# EAGLE design Simple_Boost_JST_to_1V8 (EAGLE 7.2.0)
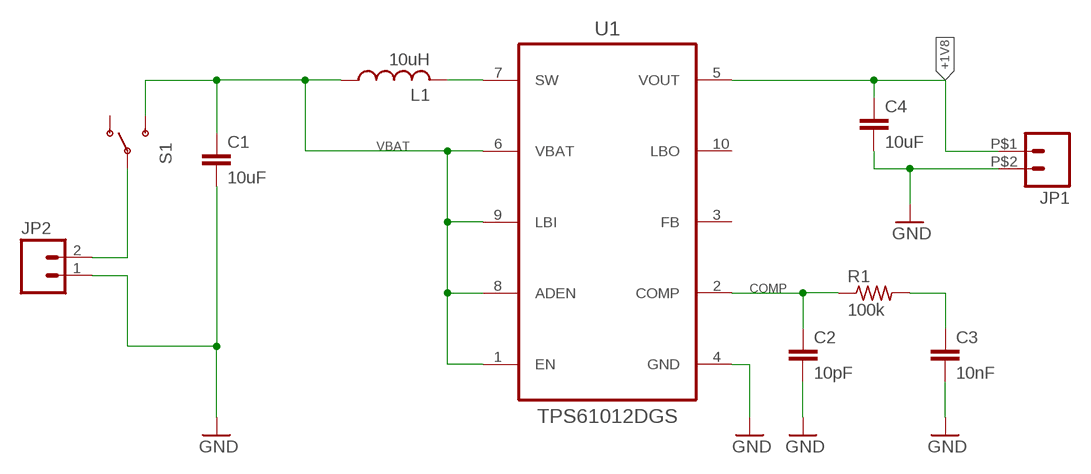
[diagram p0: schematic, sheet 1]

## Parts
C1  10uF  C-EUC1812  [C1812]
C2  10pF  C-EUC0805  [C0805]
C3  10nF  C-EUC0805  [C0805]
C4  10uF  C-EUC1812  [C1812]
JP1  M02TE-282834-2  [1X02_282834-2]
JP2  M02JST-PTH-2  [JST-2-PTH]
L1  10uH  SUMIDA_POWER_INDUCTOR6  [CDRH6D38]
R1  100k  R-US_R0805  [R0805]
S1  SWITCH-SPDTPTH  [SWITCH-SPDT]
U1  TPS61012DGS  [SOP50P490X110-10N]

## Nets
+1V8: C4.1 JP1.P$1 U1.5(VOUT)
COMP: C2.1 R1.1 U1.2(COMP)
GND: C1.2 C2.2 C3.2 C4.2 JP1.P$2 JP2.1 U1.4(GND)
N$1: C3.1 R1.2
N$2: JP2.2 S1.2(P)
SW: L1.P$2 U1.7(SW)
VBAT: C1.1 L1.P$1 S1.3(S) U1.1(EN) U1.6(VBAT) U1.8(ADEN) U1.9(LBI)
Unconnected: S1.1(O) U1.3(FB) U1.10(LBO)

## Library data of the parts
C1-C4 = rcl:C-EU: CAPACITOR, European symbol
JP1 = DensityAltitude:M02: Standard 2-pin 0.1" header. Use with - straight break away headers ( PRT-00116) - right angle break away headers (PRT-00553) - swiss pins (PRT-00743) - machine pins (PRT-00117) - female headers (PRT-00115) Molex polarized connector foot print use with: PRT-08233 with associated crimp pins and housings. 2.54_SCREWTERM for use with PRT-10571. 3.5mm Screw Terminal footprints for PRT-08084 5mm Screw Terminal footprints for use with PRT-08432
JP2 = DensityAltitude:M02: Standard 2-pin 0.1" header. Use with - straight break away headers ( PRT-00116) - right angle break away headers (PRT-00553) - swiss pins (PRT-00743) - machine pins (PRT-00117) - female headers (PRT-00115) Molex polarized connector foot print use with: PRT-08233 with associated crimp pins and housings. 2.54_SCREWTERM for use with PRT-10571. 3.5mm Screw Terminal footprints for PRT-08084 5mm Screw Terminal footprints for use with PRT-08432; PROD_ID: CONN-09863; SKU: PRT-09914
L1 = DensityAltitude:SUMIDA_POWER_INDUCTOR
R1 = rcl:R-US_: RESISTOR, American symbol
S1 = SparkFun-Electromechanical:SWITCH-SPDT: SPDT Switch Simple slide switch, Spark Fun Electronics SKU : COM-00102 DPDT SMT slide switch, AYZ0202, SWCH-08179; PROD_ID: SWCH-08261
U1 = DensityAltitude:TPS6101*: 1-CELL AND 2-CELL BOOST CONVERTERS; PACKAGE: MSOP-10; SUPPLIER: Texas Instruments; VOLTAGE: 1.8

## Net classes
1 big_power: width 1.93 mm

## Board
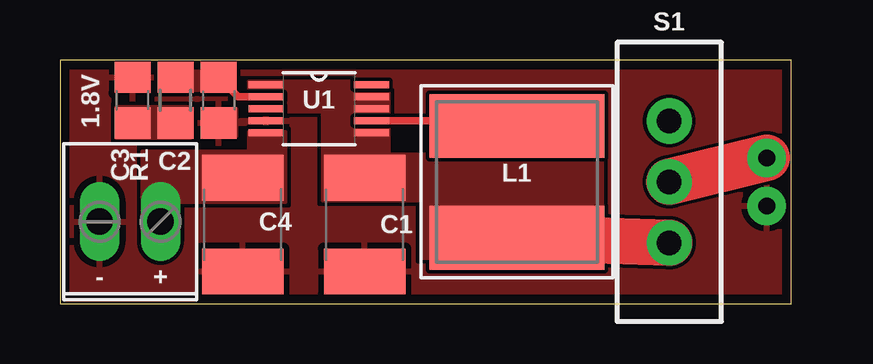
[diagram p1: board, top side]
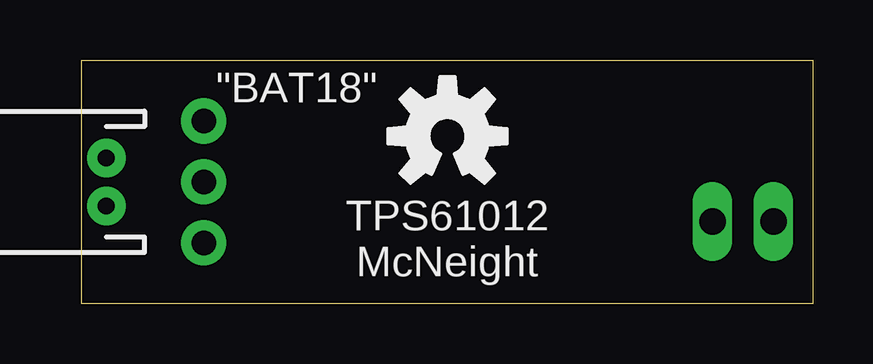
[diagram p2: board, bottom side, seen from below]

Size 30.48 x 10.16 mm. Coordinates in mm from the lower left corner, seen from the top.
Outline: 0,0 30.48,0 30.48,10.16 0,10.16 0,0
Copper layers (1*16): Top 0.0356mm / dielectric 1.5011mm / Bottom 0.0356mm
Design rules "oshpark-2layer": minimum track width 6mil, minimum drill 13mil, track to track 6mil, track to pad 6mil, pad to pad 6mil, via to via 6mil, smd to smd 6mil, copper to edge 15mil, drill to drill 6mil, minimum pad ring 7mil, minimum via ring 7mil, stop-mask expansion 4mil, vias tented up to drill 0mil, thermal gap 10mil

### Footprints (pad centres in the part's own frame; a part is rotated, then mirrored left to right if it is on the bottom)
C1812 = smd 1.9 x 3.4: 1 -1.95,0; 2 1.95,0
C0805 = smd 1.3 x 1.5: 1 -0.95,0; 2 0.95,0
1X02_282834-2 = drill 1.1 long: P$1 -1.27,0; P$2 1.27,0
JST-2-PTH = drill 0.7 pad 1.6: 1 -1,0; 2 1,0
CDRH6D38 = smd 2.65 x 7.3: P$1 -2.325,0; P$2 2.325,0
R0805 = smd 1.3 x 1.5: 1 -0.95,0; 2 0.95,0
SWITCH-SPDT = drill 1.016 pad 1.88: 1 0,2.54; 2 0,0; 3 0,-2.54
SOP50P490X110-10N = smd 1.45 x 0.3: 1 -2.2,1; 2 -2.2,0.5; 3 -2.2,0; 4 -2.2,-0.5; 5 -2.2,-1; 6 2.2,-1; 7 2.2,-0.5; 8 2.2,0; 9 2.2,0.5; 10 2.2,1

### Placement (x,y rotation side)
C1  12.7,3.3 270 top
C2  6.62,8.49 270 top
C3  3.02,8.49 90 top
C4  7.62,3.3 270 top
JP1  2.92,3.43 180 top
JP2  29.46,5.08 90 bottom
L1  19.05,5.08 90 top
R1  4.82,8.49 270 top
S1  25.4,5.08 0 top
U1  10.79,8.13 0 top
U$1  [OSHW-LOGO-M]  15.24,6.99 0 bottom

### Tracks (layer width: path | path; a pad name or v marks a point on that pad's centre or on a via)
+1V8
  pour Top (no thermals): 9.4,4.24 4.95,4.24 4.95,3.05 3.43,3.05 3.43,6.35 7.87,6.35 7.87,7.18 9.4,7.18
COMP
  Top 0.305: U1.2 7.43,8.63 C2.1
  pour Top (no thermals): 7.24,8.9 7.24,10.11 4.14,10.11 4.14,8.9
GND
  pour Top (rank 2): 0,0 0,10.16 30.48,10.16 30.48,0
  pour Top (no thermals): 5.97,8.13 5.97,6.99 7.37,6.99 7.37,8.13
N$1
  pour Top (no thermals): 5.44,6.91 5.44,8.21 2.34,8.21 2.34,6.91
N$2
  Top 1.93: JP2.2 S1.2
SW
  Top 0.305: U1.7 18.83,7.63 L1.P$2
VBAT
  Top 1.93: S1.3 L1.P$1
  pour Top (no thermals): 22.61,6.23 13.72,6.23 13.72,9.27 7.87,9.27 7.87,8 10.95,8 10.95,4.3 15.05,4.3 15.05,1.9 22.61,1.9

### Text on the board
tPlace: 1.8V | - | +
bPlace: "BAT18" | TPS61012 / McNeight